# EAGLE design mikroe-adapter (EAGLE 9.6.2)

## Sheet 1 of 2
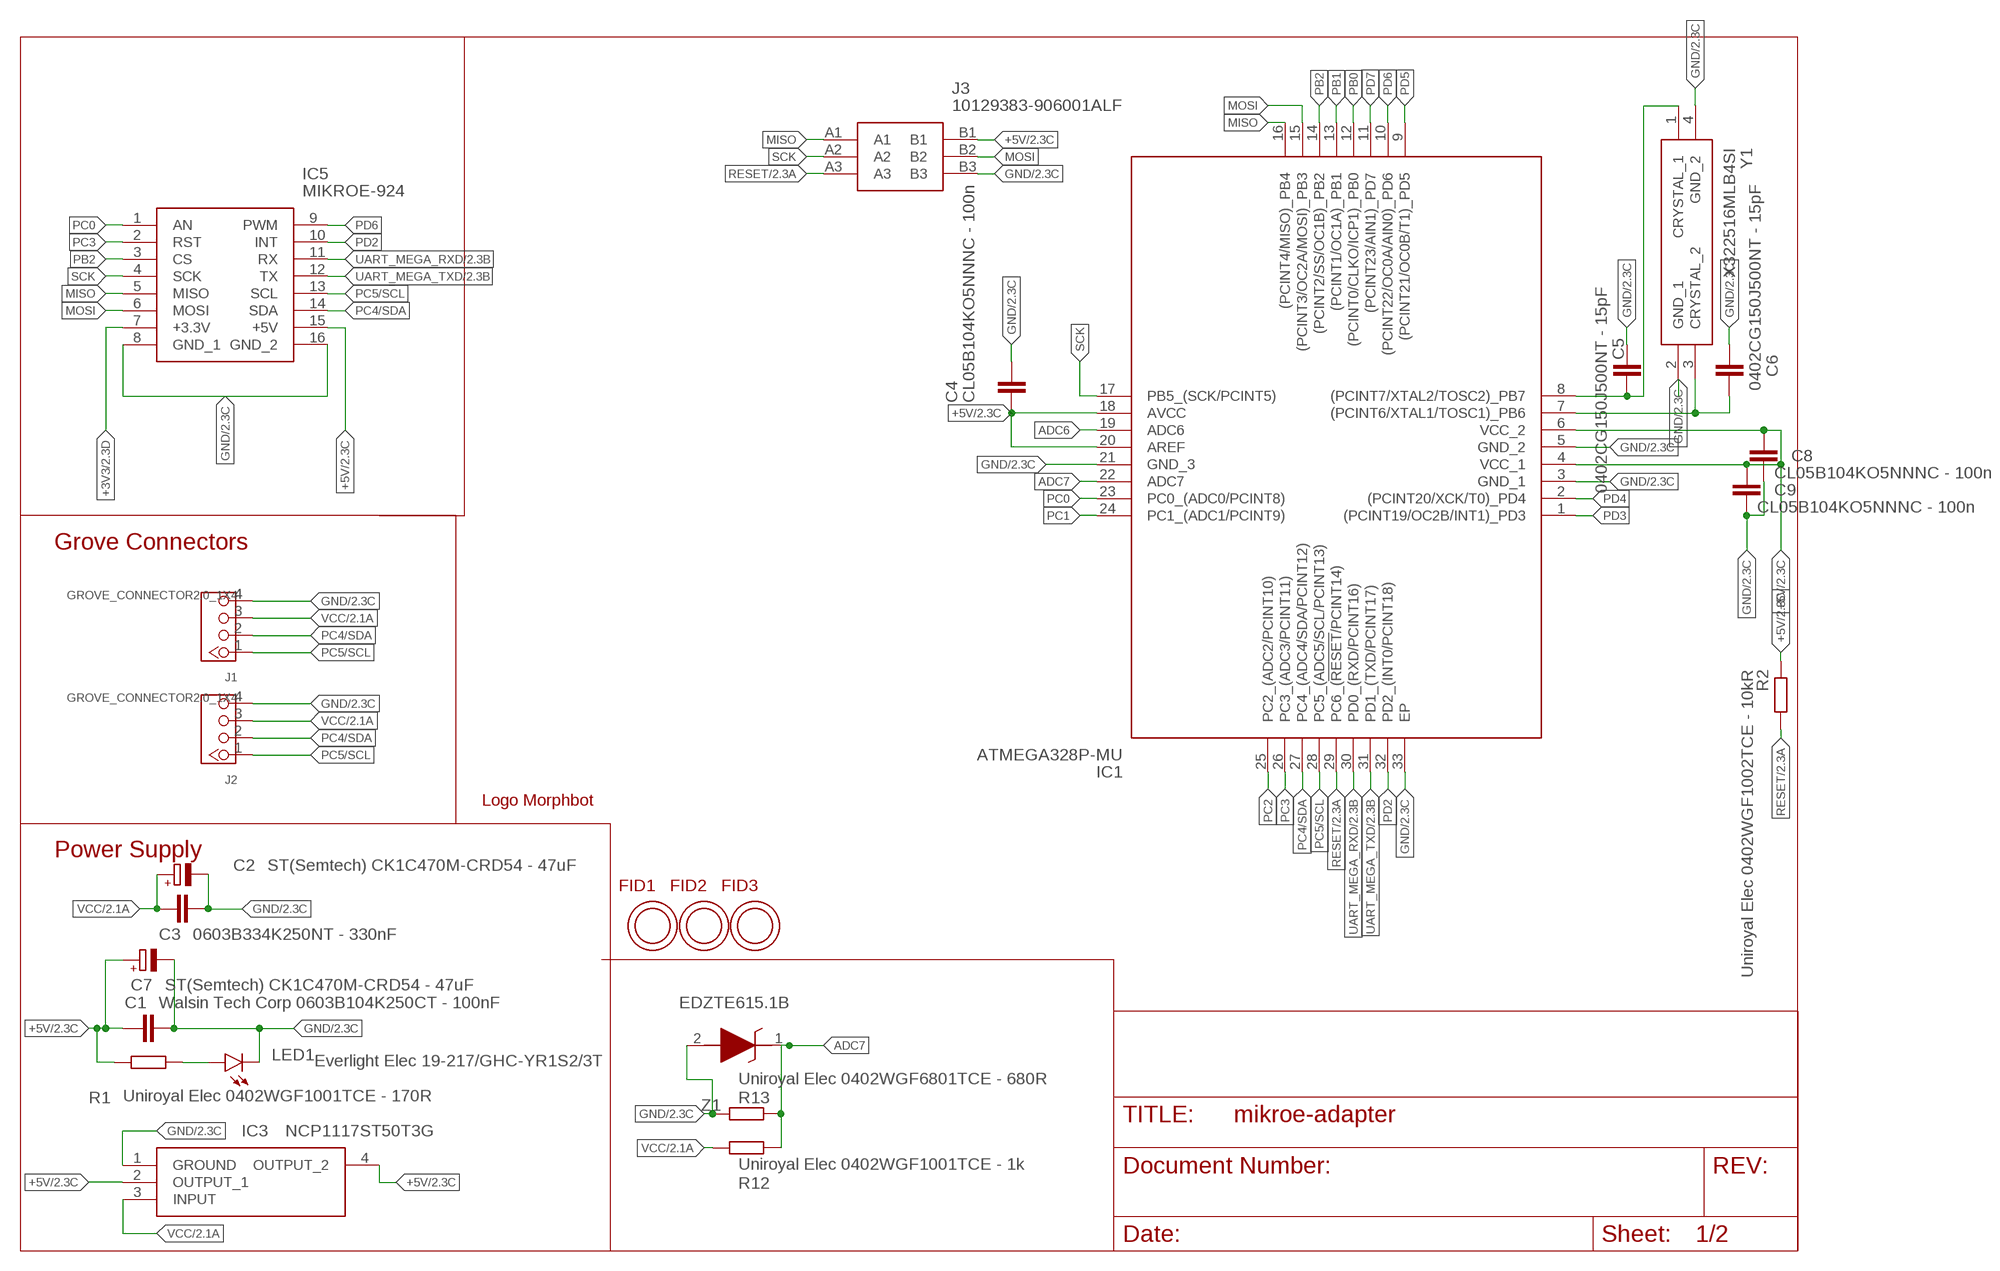
[diagram p0: schematic, sheet 1]

### Parts
C1  Walsin Tech Corp 0603B104K250CT - 100nF  C-EUC0603  [C0603]
C2  ST(Semtech) CK1C470M-CRD54 - 47uF  CPOL-EUC  [PANASONIC_C]
C3  0603B334K250NT - 330nF  C-EUC0603  [C0603]
C4  CL05B104KO5NNNC - 100n  C-EUC0402  [C0402]
C5  0402CG150J500NT - 15pF  C-EUC0402  [C0402]
C6  0402CG150J500NT - 15pF  C-EUC0402  [C0402]
C7  ST(Semtech) CK1C470M-CRD54 - 47uF  CPOL-EUC  [PANASONIC_C]
C8  CL05B104KO5NNNC - 100n  C-EUC0402  [C0402]
C9  CL05B104KO5NNNC - 100n  C-EUC0402  [C0402]
FID1  OPEN-PNP-FIDUCIAL  [OPEN-PNP-FIDUCIAL]
FID2  OPEN-PNP-FIDUCIAL  [OPEN-PNP-FIDUCIAL]
FID3  OPEN-PNP-FIDUCIAL  [OPEN-PNP-FIDUCIAL]
IC1  ATMEGA328P-MU  [QFN50P500X500X100-33N]
IC3  NCP1117ST50T3G  [SOT230P700X180-4N]
IC5  MIKROE-924  [MIKROE924]
J1  GROVE_CONNECTOR2.0_1X4  [2.0_1X4_STRAIGHT]
J2  GROVE_CONNECTOR2.0_1X4  [2.0_1X4_STRAIGHT]
J3  10129383-906001ALF  [10129383906001ALF]
LED1  Everlight Elec 19-217/GHC-YR1S2/3T  LEDCHIPLED_0603  [CHIPLED_0603]
R1  Uniroyal Elec 0402WGF1001TCE - 170R  R-EU_R0402  [R0402]
R2  Uniroyal Elec 0402WGF1002TCE - 10kR  R-EU_R0402  [R0402]
R12  Uniroyal Elec 0402WGF1001TCE - 1k  R-EU_R0402  [R0402]
R13  Uniroyal Elec 0402WGF6801TCE - 680R  R-EU_R0402  [R0402]
U$1  LOGO_MORPHBOT5MM  [LOGO_MORPHBOT]
Y1  X322516MLB4SI  [X322516MLB4SI]
Z1  EDZTE615.1B  [EMD2]

### Nets
+3V3: IC5.7(+3.3V) ; also sheet 2
+5V: C1.1 C4.1 C7.+ C8.2 C9.2 IC1.4(VCC_1) IC1.6(VCC_2) IC1.18(AVCC) IC1.20(AREF) IC3.2(OUTPUT_1) IC3.4(OUTPUT_2) IC5.15(+5V) J3.B1 R1.2 R2.2 ; also sheet 2
ADC6: IC1.19(ADC6)
ADC7: IC1.22(ADC7) R12.1 R13.2 Z1.1(K)
GND: C1.2 C2.- C3.1 C4.2 C5.1 C6.1 C7.- C8.1 C9.1 IC1.3(GND_1) IC1.5(GND_2) IC1.21(GND_3) IC1.33(EP) IC3.1(GROUND) IC5.8(GND_1) IC5.16(GND_2) J1.4 J2.4 J3.B3 LED1.C R13.1 Y1.2(GND_1) Y1.4(GND_2) Z1.2(A) ; also sheet 2
MISO: IC1.16((PCINT4/MISO)_PB4) IC5.5(MISO) J3.A1
MOSI: IC1.15((PCINT3/OC2A/MOSI)_PB3) IC5.6(MOSI) J3.B2
N$1: LED1.A R1.1
N$2: C5.2 IC1.8((PCINT7/XTAL2/TOSC2)_PB7) Y1.1(CRYSTAL_1)
N$3: C6.2 IC1.7((PCINT6/XTAL1/TOSC1)_PB6) Y1.3(CRYSTAL_2)
PB0: IC1.12((PCINT0/CLKO/ICP1)_PB0)
PB1: IC1.13((PCINT1/OC1A)_PB1)
PB2: IC1.14((PCINT2/SS/OC1B)_PB2) IC5.3(CS)
PC0: IC1.23(PC0_(ADC0/PCINT8)) IC5.1(AN)
PC1: IC1.24(PC1_(ADC1/PCINT9))
PC2: IC1.25(PC2_(ADC2/PCINT10))
PC3: IC1.26(PC3_(ADC3/PCINT11)) IC5.2(RST)
PC4/SDA: IC1.27(PC4_(ADC4/SDA/PCINT12)) IC5.14(SDA) J1.2 J2.2
PC5/SCL: IC1.28(PC5_(ADC5/SCL/PCINT13)) IC5.13(SCL) J1.1 J2.1
PD2: IC1.32(PD2_(INT0/PCINT18)) IC5.10(INT)
PD3: IC1.1((PCINT19/OC2B/INT1)_PD3)
PD4: IC1.2((PCINT20/XCK/T0)_PD4)
PD5: IC1.9((PCINT21/OC0B/T1)_PD5)
PD6: IC1.10((PCINT22/OC0A/AIN0)_PD6) IC5.9(PWM)
PD7: IC1.11((PCINT23/AIN1)_PD7)
RESET: IC1.29(PC6_(!RESET!/PCINT14)) J3.A3 R2.1 ; also sheet 2
SCK: IC1.17(PB5_(SCK/PCINT5)) IC5.4(SCK) J3.A2
UART_MEGA_RXD: IC1.30(PD0_(RXD/PCINT16)) IC5.11(RX) ; also sheet 2
UART_MEGA_TXD: IC1.31(PD1_(TXD/PCINT17)) IC5.12(TX) ; also sheet 2
VCC: C2.+ C3.2 IC3.3(INPUT) J1.3 J2.3 R12.2 ; also sheet 2

### Notes on the sheet
- Grove Connectors
- Power Supply

## Sheet 2 of 2
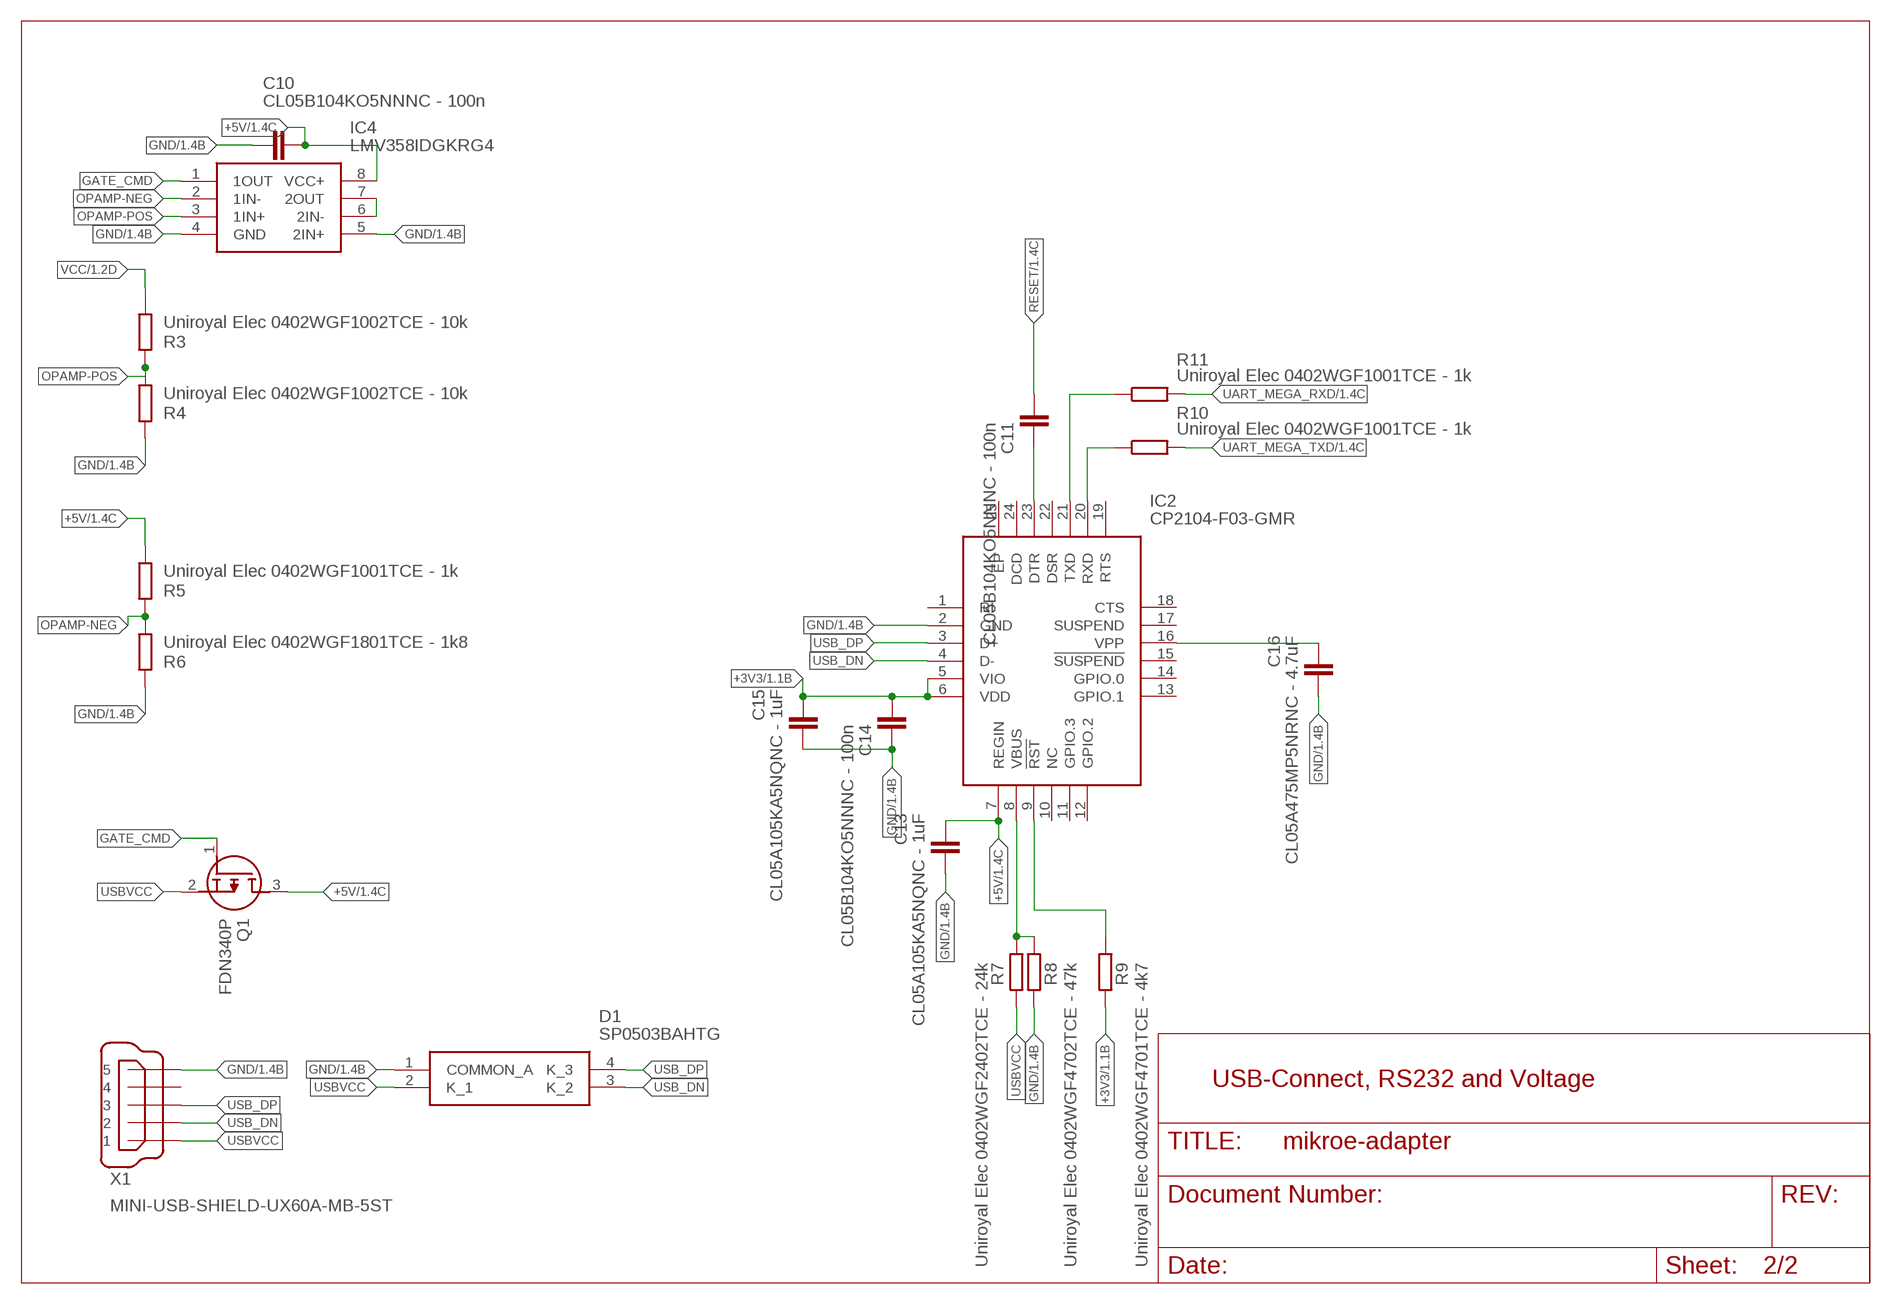
[diagram p1: schematic, sheet 2]

### Parts
C10  CL05B104KO5NNNC - 100n  C-EUC0402  [C0402]
C11  CL05B104KO5NNNC - 100n  C-EUC0402  [C0402]
C13  CL05A105KA5NQNC - 1uF  C-EUC0402  [C0402]
C14  CL05B104KO5NNNC - 100n  C-EUC0402  [C0402]
C15  CL05A105KA5NQNC - 1uF  C-EUC0402  [C0402]
C16  CL05A475MP5NRNC - 4.7uF  C-EUC0402  [C0402]
D1  SP0503BAHTG  [SP0503BAHTG]
IC2  CP2104-F03-GMR  [QFN50P400X400X80-25N]
IC4  LMV358IDGKRG4  [SOP65P490X110-8N]
Q1  FDN340P  [SOT95P237X112-3N]
R3  Uniroyal Elec 0402WGF1002TCE - 10k  R-EU_R0402  [R0402]
R4  Uniroyal Elec 0402WGF1002TCE - 10k  R-EU_R0402  [R0402]
R5  Uniroyal Elec 0402WGF1001TCE - 1k  R-EU_R0402  [R0402]
R6  Uniroyal Elec 0402WGF1801TCE - 1k8  R-EU_R0402  [R0402]
R7  Uniroyal Elec 0402WGF2402TCE - 24k  R-EU_R0402  [R0402]
R8  Uniroyal Elec 0402WGF4702TCE - 47k  R-EU_R0402  [R0402]
R9  Uniroyal Elec 0402WGF4701TCE - 4k7  R-EU_R0402  [R0402]
R10  Uniroyal Elec 0402WGF1001TCE - 1k  R-EU_R0402  [R0402]
R11  Uniroyal Elec 0402WGF1001TCE - 1k  R-EU_R0402  [R0402]
X1  MINI-USB-SHIELD-UX60A-MB-5ST  [UX60A-MB-5ST]

### Nets
+3V3: C14.2 C15.2 IC2.5(VIO) IC2.6(VDD) R9.2 ; also sheet 1
+5V: C10.2 C13.2 IC2.7(REGIN) IC4.8(VCC+) Q1.3(D) R5.1 ; also sheet 1
DTR: C11.1 IC2.23(DTR)
GATE_CMD: IC4.1(1OUT) Q1.1(G)
GND: C10.1 C13.1 C14.1 C15.1 C16.1 D1.1(COMMON_A) IC2.2(GND) IC4.4(GND) IC4.5(2IN+) R4.2 R6.2 R8.2 X1.5 ; also sheet 1
N$4: IC4.6(2IN-) IC4.7(2OUT)
N$5: IC2.8(VBUS) R7.1 R8.1
N$6: IC2.9(!RST) R9.1
N$7: C16.2 IC2.16(VPP)
N$8: IC2.21(TXD) R11.1
N$9: IC2.20(RXD) R10.1
OPAMP-NEG: IC4.2(1IN-) R5.2 R6.1
OPAMP-POS: IC4.3(1IN+) R3.2 R4.1
RESET: C11.2 ; also sheet 1
UART_MEGA_RXD: R11.2 ; also sheet 1
UART_MEGA_TXD: R10.2 ; also sheet 1
USB_DN: D1.3(K_2) IC2.4(D-) X1.2
USB_DP: D1.4(K_3) IC2.3(D+) X1.3
USBVCC: D1.2(K_1) Q1.2(S) R7.2 X1.1
VCC: R3.1 ; also sheet 1
Unconnected: IC2.1(RI) IC2.10(NC) IC2.11(GPIO.3) IC2.12(GPIO.2) IC2.13(GPIO.1) IC2.14(GPIO.0) IC2.15(!SUSPEND) IC2.17(SUSPEND) IC2.18(CTS) IC2.19(RTS) IC2.22(DSR) IC2.24(DCD) IC2.25(EP) X1.4 X1.M1(S1) X1.M2(S2) X1.M3(S3) X1.M4(S4)

### Notes on the sheet
- USB-Connect, RS232 and Voltage

## Library data of the parts
C1 C3-C6 C8-C11 C13-C16 = rcl:C-EU: CAPACITOR, European symbol; SPICEPREFIX: C
C2 C7 = rcl:CPOL-EU: POLARIZED CAPACITOR, European symbol; SPICEPREFIX: C
D1 = samacsys:SP0503BAHTG: ESD Suppressors / TVS Diodes TVS AVAL DIODE SMT Source: Datasheet <https://nl.mouser.com/datasheet/2/240/Littelfuse_TVS_Diode_Array_SP05_Datasheet.pdf-777043.pdf>; ARROW_PART_NUMBER: SP0503BAHTG; ARROW_PRICE-STOCK: https://www.arrow.com/en/products/sp0503bahtg/littelfuse; DESCRIPTION: ESD Suppressors / TVS Diodes TVS AVAL DIODE SMT; HEIGHT: 1.22mm; MANUFACTURER_NAME: LITTELFUSE; MANUFACTURER_PART_NUMBER: SP0503BAHTG; MOUSER_PART_NUMBER: 576-SP0503BAHTG; MOUSER_PRICE-STOCK: https://www.mouser.co.uk/ProductDetail/Littelfuse/SP0503BAHTG?qs=uD%2FdkN7XIa0NTYXwHdELYA%3D%3D
FID1-FID3 = topo-eng:OPEN-PNP-FIDUCIAL
IC1 = samacsys:ATMEGA328P-MU: ATMEGA328P-MU, 8 bit AVR Microcontroller 20MHz 1, 32kb Flash, 2kb RAM, I2C SPI 32-Pin MLF Source: Datasheet <http://www.atmel.com/Images/Atmel-8271-8-bit-AVR-Microcontroller-ATmega48A-48PA-88A-88PA-168A-168PA-328-328P_datasheet.pdf>; ARROW_PART_NUMBER: ATMEGA328P-MU; ARROW_PRICE-STOCK: https://www.arrow.com/en/products/atmega328p-mu/microchip-technology; DESCRIPTION: ATMEGA328P-MU, 8 bit AVR Microcontroller 20MHz 1, 32kb Flash, 2kb RAM, I2C SPI 32-Pin MLF; HEIGHT: 1mm; MANUFACTURER_NAME: Microchip; MANUFACTURER_PART_NUMBER: ATMEGA328P-MU; MOUSER_PART_NUMBER: 556-ATMEGA328P-MU; MOUSER_PRICE-STOCK: https://www.mouser.co.uk/ProductDetail/Microchip-Technology-Atmel/ATMEGA328P-MU?qs=K8BHR703ZXgI55tOEPBx9w%3D%3D
IC2 = samacsys:CP2104-F03-GMR: USB-to-UART 1-CH 576byte FIFO 3.3V Automotive 24-Pin QFN EP T/R Source: Datasheet <https://www.silabs.com/documents/public/data-sheets/cp2104.pdf>; ARROW_PART_NUMBER: CP2104-F03-GMR; ARROW_PRICE-STOCK: https://www.arrow.com/en/products/cp2104-f03-gmr/silicon-labs; DESCRIPTION: USB-to-UART 1-CH 576byte FIFO 3.3V Automotive 24-Pin QFN EP T/R; HEIGHT: 0.8mm; MANUFACTURER_NAME: Silicon Labs; MANUFACTURER_PART_NUMBER: CP2104-F03-GMR; MOUSER_PART_NUMBER: 634-CP2104-F03-GMR; MOUSER_PRICE-STOCK: https://www.mouser.co.uk/ProductDetail/Silicon-Labs/CP2104-F03-GMR?qs=1CB38rTTsYrRJKVkczeRzA%3D%3D
IC3 = samacsys:NCP1117ST50T3G: ON SEMICONDUCTOR - NCP1117ST50T3G - LDO, REG, 20VIN, 1A, 5V, 1%, SOT223-3 Source: Datasheet <http://www.onsemi.com/pub/Collateral/NCP1117-D.PDF>; ARROW_PART_NUMBER: NCP1117ST50T3G; ARROW_PRICE-STOCK: https://www.arrow.com/en/products/ncp1117st50t3g/on-semiconductor; DESCRIPTION: ON SEMICONDUCTOR - NCP1117ST50T3G - LDO, REG, 20VIN, 1A, 5V, 1%, SOT223-3; HEIGHT: 1.8mm; MANUFACTURER_NAME: ON Semiconductor; MANUFACTURER_PART_NUMBER: NCP1117ST50T3G; MOUSER_PART_NUMBER: 863-NCP1117ST50T3G; MOUSER_PRICE-STOCK: https://www.mouser.co.uk/ProductDetail/ON-Semiconductor/NCP1117ST50T3G?qs=Gev%252BmEvV0ib6dijy6U0dhQ%3D%3D
IC4 = samacsys:LMV358IDGKRG4: Operational Amplifiers - Op Amps Dual Low-Voltage Rail-to-Rail Out Source: Datasheet <http://www.ti.com/lit/ds/symlink/lmv358.pdf>; ARROW_PART_NUMBER: LMV358IDGKRG4; ARROW_PRICE-STOCK: https://www.arrow.com/en/products/lmv358idgkrg4/texas-instruments; DESCRIPTION: Operational Amplifiers - Op Amps Dual Low-Voltage Rail-to-Rail Out; HEIGHT: 1.1mm; MANUFACTURER_NAME: Texas Instruments; MANUFACTURER_PART_NUMBER: LMV358IDGKRG4; MOUSER_PART_NUMBER: 595-LMV358IDGKRG4; MOUSER_PRICE-STOCK: https://www.mouser.co.uk/ProductDetail/Texas-Instruments/LMV358IDGKRG4?qs=paYhMW8qfiuzqo4cLPZoVQ%3D%3D
IC5 = samacsys:MIKROE-924: microSD click mikroBUS Source: Datasheet <https://www.mikroe.com/microsd-click>; DESCRIPTION: microSD click mikroBUS; HEIGHT: 5mm; MANUFACTURER_NAME: MIKROELEKTRONIKA; MANUFACTURER_PART_NUMBER: MIKROE-924; MOUSER_PART_NUMBER: 932-MIKROE-924; MOUSER_PRICE-STOCK: https://www.mouser.com/Search/Refine.aspx?Keyword=932-MIKROE-924
J1 J2 = morphbot:GROVE_CONNECTOR: Seeedstudio Grove-Connector: 1 = SCL 2 = SDA 3 = VCC 4 = GND
J3 = samacsys:10129383-906001ALF: Headers & Wire Housings ECONOSTIK HEADER DR VT SMT 2X3 Source: Datasheet <https://componentsearchengine.com/Datasheets/1/10129383-906001ALF.pdf>; ARROW_PART_NUMBER: 10129383-906001ALF; ARROW_PRICE-STOCK: https://www.arrow.com/en/products/10129383-906001alf/amphenol-fci; DESCRIPTION: Headers & Wire Housings ECONOSTIK HEADER DR VT SMT 2X3; HEIGHT: 8.58mm; MANUFACTURER_NAME: Amphenol; MANUFACTURER_PART_NUMBER: 10129383-906001ALF; MOUSER_PART_NUMBER: 649-1012938390601ALF; MOUSER_PRICE-STOCK: https://www.mouser.co.uk/ProductDetail/Amphenol-FCI/10129383-906001ALF?qs=0lQeLiL1qyZsINMRDvT9Pw%3D%3D
LED1 = led:LED: LED OSRAM: - CHIPLED LG R971, LG N971, LY N971, LG Q971, LY Q971, LO R971, LY R971 LH N974, LH R974 LS Q976, LO Q976, LY Q976 LO Q996 - Hyper CHIPLED LW Q18S LB Q993, LB Q99A, LB R99A - SideLED LS A670, LO A670, LY A670, LG A670, LP A670 LB A673, LV A673, LT A673, LW A673 LH A674 LY A675 LS A676, LA A676, LO A676, LY A676, LW A676 LS A679, LY A679, LG A679 - Hyper Micro SIDELED® LS Y876, LA Y876, LO Y876, LY Y876 LT Y87S - SmartLED LW L88C, LW L88S LB L89C, LB L89S, LG L890 LS L89K, LO L89K, LY L89K LS L896, LA L896, LO L896, LY L896 - TOPLED LS T670, LO T670, LY T670, LG T670, LP T670 LSG T670, LSP T670, LSY T670, LOP T670, LYG T670 LG T671, LOG T671, LSG T671 LB T673, LV T673, LT T673, LW T673 LH T674 LS T676, LA T676, LO T676, LY T676, LB T676, LH T676, LSB T676, LW T676 LB T67C, LV T67C, LT T67C, LS T67K, LO T67K, LY T67K, LW E67C LS E67B, LA E67B, LO E67B, LY E67B, LB E67C, LV E67C, LT E67C LW T67C LS T679, LY T679, LG T679 LS T770, LO T770, LY T770, LG T770, LP T770 LB T773, LV T773, LT T773, LW T773 LH T774 LS E675, LA E675, LY E675, LS T675 LS T776, LA T776, LO T776, LY T776, LB T776 LHGB T686 LT T68C, LB T68C - Hyper Mini TOPLED® LB M676 - Mini TOPLED Santana® LG M470 LS M47K, LO M47K, LY M47K Source: http://www.osram.convergy.de LUXEON: - LUMILED® LXK2-PW12-R00, LXK2-PW12-S00, LXK2-PW14-U00, LXK2-PW14-V00 LXK2-PM12-R00, LXK2-PM12-S00, LXK2-PM14-U00 LXK2-PE12-Q00, LXK2-PE12-R00, LXK2-PE12-S00, LXK2-PE14-T00, LXK2-PE14-U00 LXK2-PB12-K00, LXK2-PB12-L00, LXK2-PB12-M00, LXK2-PB14-N00, LXK2-PB14-P00, LXK2-PB14-Q00 LXK2-PR12-L00, LXK2-PR12-M00, LXK2-PR14-Q00, LXK2-PR14-R00 LXK2-PD12-Q00, LXK2-PD12-R00, LXK2-PD12-S00 LXK2-PH12-R00, LXK2-PH12-S00 LXK2-PL12-P00, LXK2-PL12-Q00, LXK2-PL12-R00 Source: www.luxeon.com KINGBRIGHT: KA-3528ASYC Source: www.kingbright.com
Q1 = samacsys:FDN340P: Trans MOSFET P-CH 20V 2A 3-Pin SuperSOT Source: Datasheet <https://www.onsemi.com/pub/Collateral/FDN340P-D.PDF>; ARROW_PART_NUMBER: FDN340P; ARROW_PRICE-STOCK: https://www.arrow.com/en/products/fdn340p/on-semiconductor; DESCRIPTION: Trans MOSFET P-CH 20V 2A 3-Pin SuperSOT; HEIGHT: 1.12mm; MANUFACTURER_NAME: ON Semiconductor; MANUFACTURER_PART_NUMBER: FDN340P; MOUSER_PART_NUMBER: 512-FDN340P; MOUSER_PRICE-STOCK: https://www.mouser.co.uk/ProductDetail/ON-Semiconductor-Fairchild/FDN340P?qs=AMp2PTjoga9dhzFXRaqTZw%3D%3D
R1-R13 = rcl:R-EU_: RESISTOR, European symbol; SPICEPREFIX: R
U$1 = topo-eng:LOGO_MORPHBOT
X1 = con-hirose:MINI-USB-SHIELD-: MINI USB Connector Source: http://www.hirose.co.jp/cataloge_hp/e24000019.pdf; OC_FARNELL: unknown; OC_NEWARK: unknown
Y1 = samacsys:X322516MLB4SI: Crystal Source: Datasheet <https://datasheet.lcsc.com/szlcsc/Yangxing-Tech-X322516MLB4SI_C13738.pdf>; DESCRIPTION: Crystal; HEIGHT: 0.8mm; MANUFACTURER_NAME: Yangxing Tech; MANUFACTURER_PART_NUMBER: X322516MLB4SI
Z1 = samacsys:EDZTE615.1B: ROHM EDZTE615.1B Zener Diode, 5.1V 2% 0.1 W SMT 2-Pin EMD Source: Datasheet <https://www.rohm.com/datasheet/EDZ5.1B>; DESCRIPTION: ROHM EDZTE615.1B Zener Diode, 5.1V 2% 0.1 W SMT 2-Pin EMD; HEIGHT: mm; MANUFACTURER_NAME: ROHM Semiconductor; MANUFACTURER_PART_NUMBER: EDZTE615.1B; MOUSER_PART_NUMBER: 755-EDZTE615.1B; MOUSER_PRICE-STOCK: https://www.mouser.co.uk/ProductDetail/ROHM-Semiconductor/EDZTE6151B?qs=4kLU8WoGk0uAJO8EOvJm8g%3D%3D

## Board
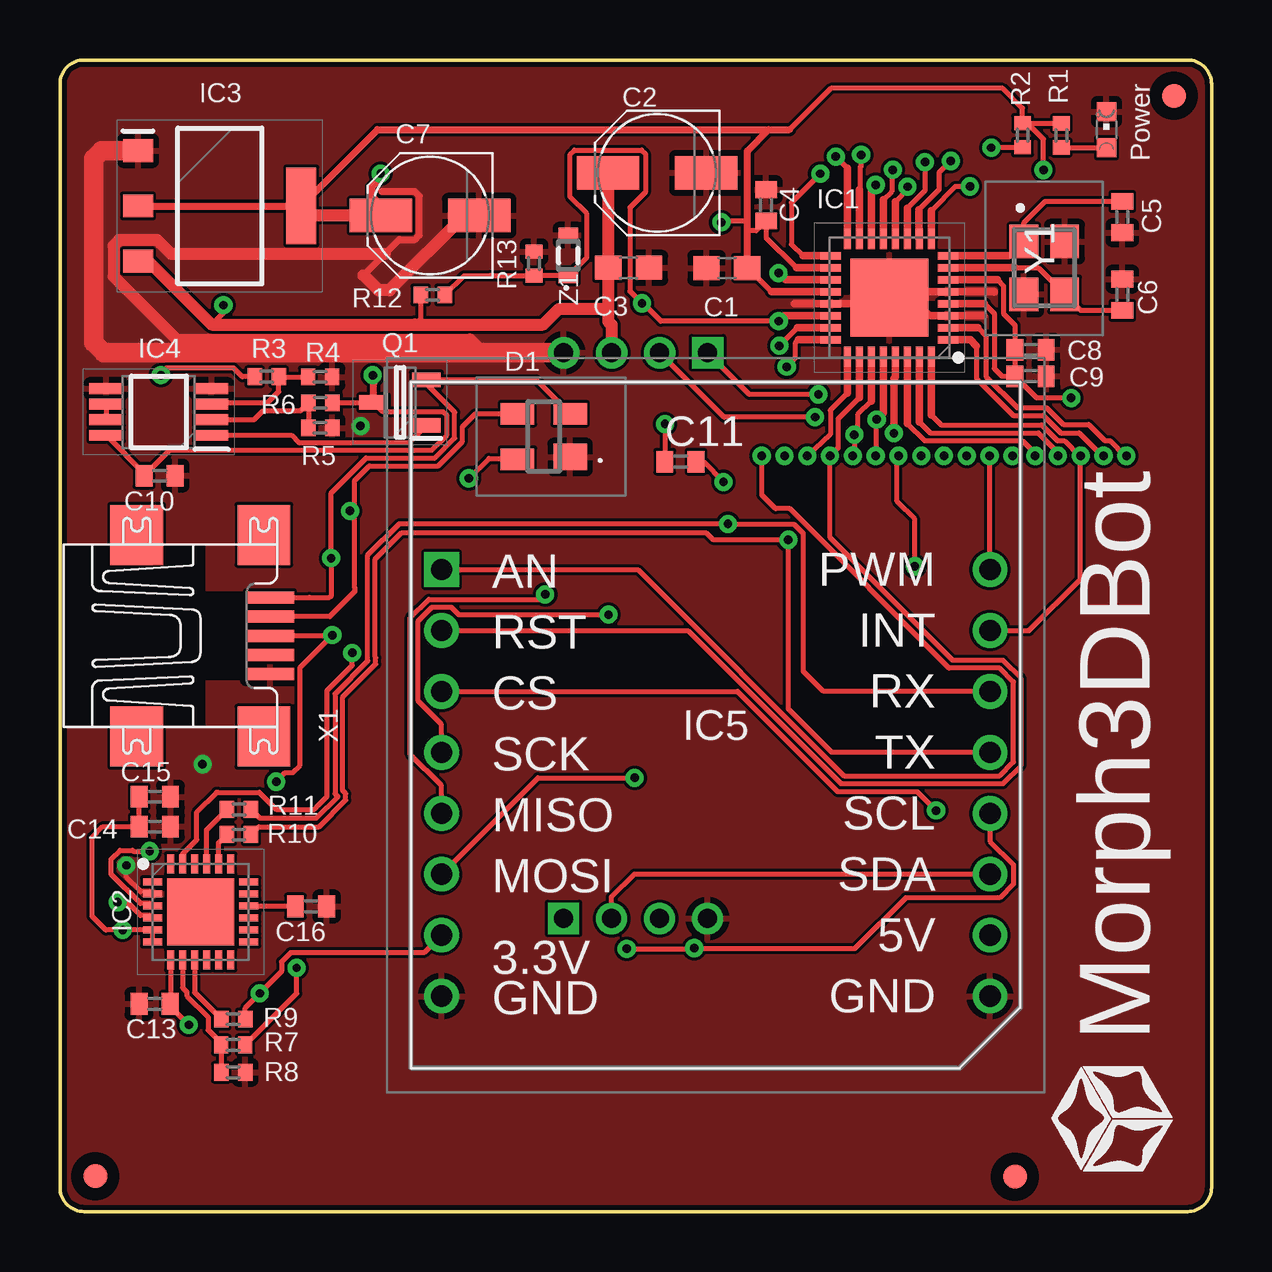
[diagram p2: board, top side]
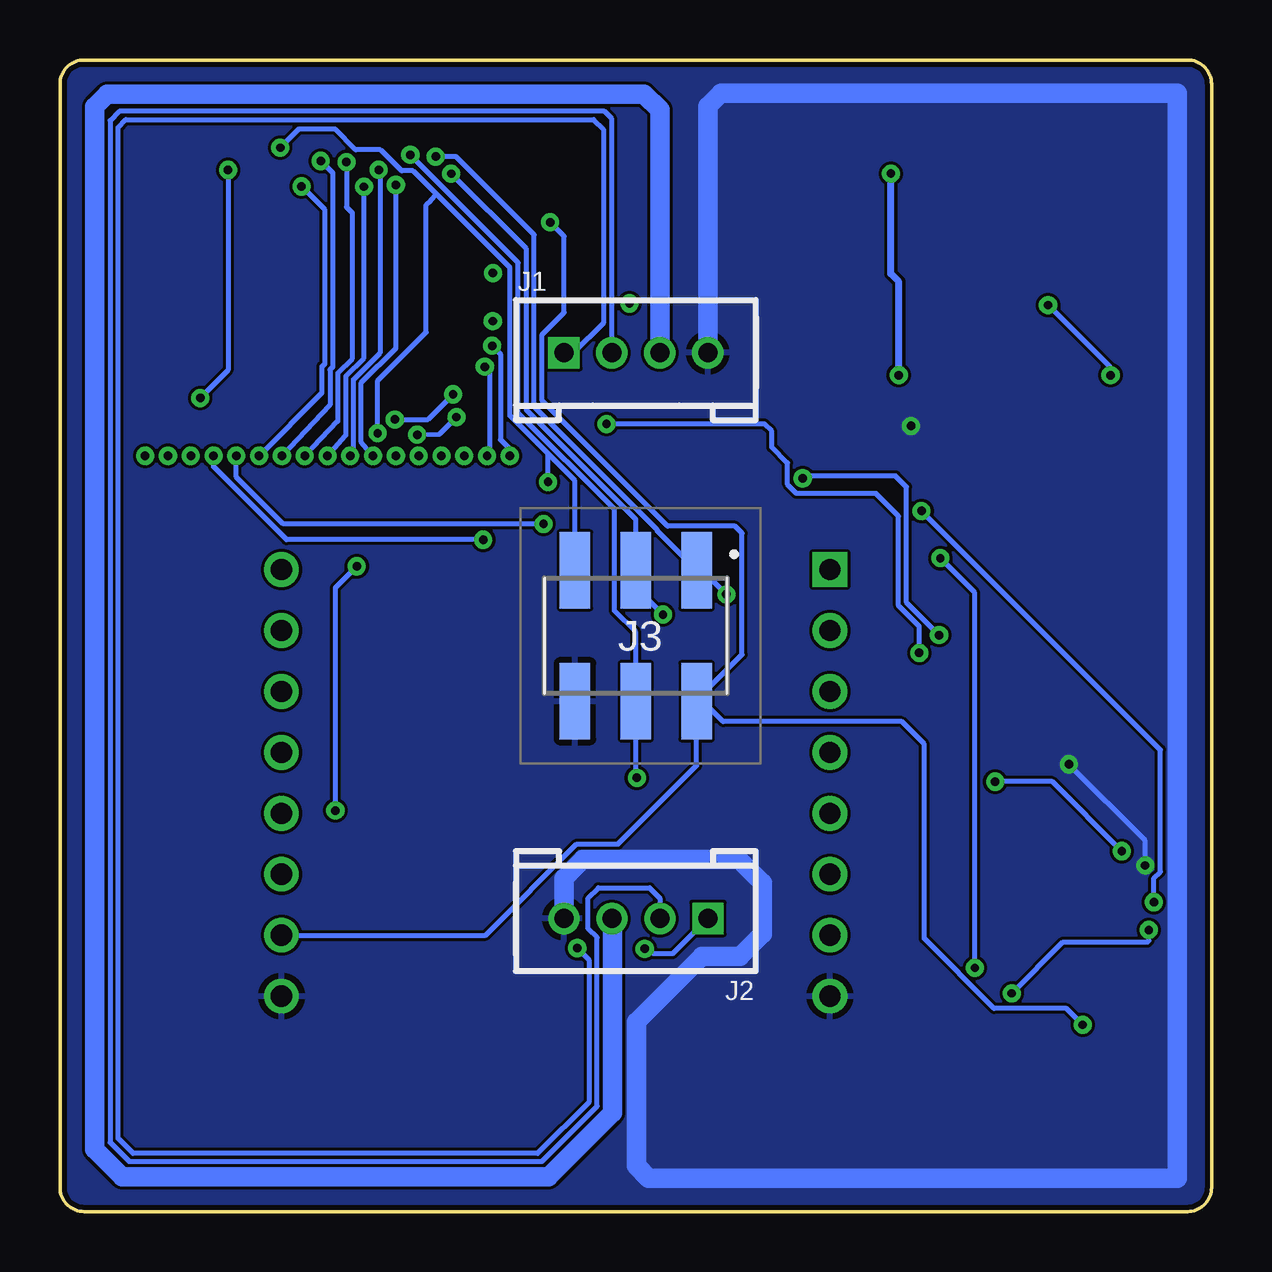
[diagram p3: board, bottom side, seen from below]

Size 48 x 48 mm. Coordinates in mm from the lower left corner, seen from the top.
Outline: 47,0 1,0 arc-90 0,1 0,47 arc-90 1,48 47,48 arc-90 48,47 48,1 arc-90 47,0
Copper layers (1*16): Top 0.035mm / dielectric 0.2mm / Bottom 0.035mm
Design rules "jlcpcb_4_layer *": minimum track width 3.5mil, minimum drill 0.2mm, track to track 5mil, track to pad 6mil, pad to pad 6mil, via to via 6mil, smd to smd 6mil, copper to edge 0.2mm, drill to drill 6mil, minimum pad ring 10mil, minimum via ring 8mil, stop-mask expansion 4mil, vias tented up to drill 0mil, thermal gap 10mil
bKeepout: area 24,0 to 48,48; area 0,0 to 24,48

### Footprints (pad centres in the part's own frame; a part is rotated, then mirrored left to right if it is on the bottom)
C0603 = smd 1.1 x 1: 1 -0.85,0; 2 0.85,0
PANASONIC_C = smd 2.6 x 1.4: + 2.05,0; - -2.05,0
C0402 = smd 0.7 x 0.9: 1 -0.65,0; 2 0.65,0
SP0503BAHTG = smd 1.1 x 1.4: 1 -0.85,-1.1 | smd 0.9 x 1.4: 2 0.95,-1.1; 3 0.95,1.1; 4 -0.95,1.1
OPEN-PNP-FIDUCIAL = smd 1 x 1: FID$1 0,0
QFN50P500X500X100-33N = smd 0.85 x 0.3: 1 -2.45,1.75; 2 -2.45,1.25; 3 -2.45,0.75; 4 -2.45,0.25; 5 -2.45,-0.25; 6 -2.45,-0.75; 7 -2.45,-1.25; 8 -2.45,-1.75; 17 2.45,-1.75; 18 2.45,-1.25; 19 2.45,-0.75; 20 2.45,-0.25; 21 2.45,0.25; 22 2.45,0.75; 23 2.45,1.25; 24 2.45,1.75 | smd 0.3 x 0.85: 9 -1.75,-2.45; 10 -1.25,-2.45; 11 -0.75,-2.45; 12 -0.25,-2.45; 13 0.25,-2.45; 14 0.75,-2.45; 15 1.25,-2.45; 16 1.75,-2.45; 25 1.75,2.45; 26 1.25,2.45; 27 0.75,2.45; 28 0.25,2.45; 29 -0.25,2.45; 30 -0.75,2.45; 31 -1.25,2.45; 32 -1.75,2.45 | smd 3.25 x 3.25: 33 0,0
QFN50P400X400X80-25N = smd 0.8 x 0.3: 1 -2,1.25; 2 -2,0.75; 3 -2,0.25; 4 -2,-0.25; 5 -2,-0.75; 6 -2,-1.25; 13 2,-1.25; 14 2,-0.75; 15 2,-0.25; 16 2,0.25; 17 2,0.75; 18 2,1.25 | smd 0.3 x 0.8: 7 -1.25,-2; 8 -0.75,-2; 9 -0.25,-2; 10 0.25,-2; 11 0.75,-2; 12 1.25,-2; 19 1.25,2; 20 0.75,2; 21 0.25,2; 22 -0.25,2; 23 -0.75,2; 24 -1.25,2 | smd 2.8 x 2.8: 25 0,0
SOT230P700X180-4N = smd 1.25 x 0.95: 1 -3.4,2.3; 2 -3.4,0; 3 -3.4,-2.3 | smd 1.25 x 3.2: 4 3.4,0
SOP65P490X110-8N = smd 1.4 x 0.45: 1 -2.2,0.975; 2 -2.2,0.325; 3 -2.2,-0.325; 4 -2.2,-0.975; 5 2.2,-0.975; 6 2.2,-0.325; 7 2.2,0.325; 8 2.2,0.975
MIKROE924 = drill 0.889 pad 1.445 square: 1 0,0 | drill 0.889 pad 1.445: 2 0,-2.54; 3 0,-5.08; 4 0,-7.62; 5 0,-10.16; 6 0,-12.7; 7 0,-15.24; 8 0,-17.78; 9 22.86,0; 10 22.86,-2.54; 11 22.86,-5.08; 12 22.86,-7.62; 13 22.86,-10.16; 14 22.86,-12.7; 15 22.86,-15.24; 16 22.86,-17.78
2.0_1X4_STRAIGHT = drill 0.8 pad 1.27 square: 1 1.83,-1.786 | drill 0.8 pad 1.27: 2 3.83,-1.786; 3 5.83,-1.786; 4 7.83,-1.786
10129383906001ALF = smd 1.27 x 3.18: A1 -2.54,-2.73; A2 0,-2.73; A3 2.54,-2.73; B1 -2.54,2.73; B2 0,2.73; B3 2.54,2.73
CHIPLED_0603 = smd 0.8 x 0.8: A 0,-0.75; C 0,0.75
SOT95P237X112-3N = smd 1.2 x 0.6: 1 -1.1,0.95; 2 -1.1,-0.95; 3 1.1,0
R0402 = smd 0.6 x 0.7: 1 -0.5,0; 2 0.5,0
UX60A-MB-5ST = smd 2 x 0.5: 1 2.25,1.6; 2 2.25,0.8; 3 2.25,0; 4 2.25,-0.8; 5 2.25,-1.6 | smd 2.2 x 2.5: M1 -3.3,-4.2; M2 -3.3,4.2; M3 2,4.2; M4 2,-4.2
X322516MLB4SI = smd 1.4 x 1.2: 1 -1.1,-0.85; 2 1.1,-0.85; 3 1.1,0.85; 4 -1.1,0.85
EMD2 = smd 0.6 x 0.8: 1 -0.85,0; 2 0.85,0

### Placement (x,y rotation side)
C1  27.8,39.33 180 top
C2  24.89,43.29 180 top
C3  23.7,39.34 180 top
C4  29.43,41.94 90 top
C5  44.28,41.45 90 top
C6  44.28,38.22 270 top
C7  15.43,41.52 180 top
C8  40.46,35.92 180 top
C9  40.46,34.82 180 top
C10  4.15,30.67 180 top
C11  25.86,31.26 0 top
C13  3.95,8.66 0 top
C14  3.96,16.05 180 top
C15  3.96,17.29 180 top
C16  10.46,12.72 180 top
D1  20.17,32.3 90 top
FID1  1.47,1.47 0 top
FID2  39.8,1.45 0 top
FID3  46.43,46.5 0 top
IC1  34.57,38.08 180 top
IC2  5.86,12.49 0 top
IC3  6.66,41.92 0 top
IC4  4.12,33.33 180 top
IC5  15.91,26.76 0 top
J1  28.83,37.58 0 bottom
J2  19.16,10.43 180 bottom
J3  24,24 180 bottom
LED1  43.62,45.09 0 top
Q1  14.17,33.72 180 top
R1  41.74,44.85 90 top
R2  40.12,44.86 90 top
R3  8.62,34.8 0 top
R4  10.84,34.79 0 top
R5  10.86,33.71 180 top
R6  10.85,32.66 0 top
R7  7.22,6.95 0 top
R8  7.22,5.8 0 top
R9  7.22,8.02 0 top
R10  7.46,15.71 0 top
R11  7.47,16.76 0 top
R12  15.54,38.21 180 top
R13  19.76,39.51 270 top
U$1  46.63,1.12 90 top
X1  6.5,24 0 top
Y1  41.03,39.33 270 top
Z1  21.19,39.85 90 top

### Tracks (layer width: path | path; a pad name or v marks a point on that pad's centre or on a via)
+3V3  (via drill 0.35)
  Top 0.2: IC2.6 IC2.5 v2.61,11.74 1.91,11.74 1.34,12.3 1.34,15.6 1.79,16.05 C14.2 C15.2 | R9.2 7.72,8.49 v8.33,9.09 9.23,10 9.23,10.42 9.6,10.79 15.18,10.79 IC5.7
  Bottom 0.2: v8.33,9.09 8.32,9.1 6.19,11.23 2.68,11.23 2.61,11.3 v2.61,11.74
+5V  (via drill 0.35)
  Top 0.2: 30.41,45.09 32.14,46.82 39.3,46.82 40.12,46 R2.2 40.33,45.37 | 40.33,45.37 41.73,45.37 R1.2 | v40.99,43.42 40.99,44.7 40.33,45.37 | v27.57,41.23 27.64,41.3 28.65,41.3 | C8.2 39.81,36.95 39.33,37.43 39.33,38.58 39.07,38.83 | C9.2 39.27,34.82 38.94,35.14 38.94,37.43 38.54,37.83 | C8.2 | C8.2 C9.2 | v42.15,33.91 40.72,33.91 C9.2 | 28.65,40.88 29.02,40.88 C4.1 29.43,40.6 30.69,39.34 | IC1.18 | 29.65,38.33 C1.1 | R5.1 Q1.3 13.47,33.33 15.98,33.33 16.13,33.18 16.13,32.37 15.49,31.73 4.57,31.73 C10.2 3.5,30.77 IC4.8 | C13.2 4.61,8.67 IC2.7 4.61,8.54 v5.37,7.78
  Top 0.3: 29.54,45.09 30.41,45.09 | C1.1 28.65,40.88 28.65,41.3 28.65,44.21 29.54,45.09 | IC3.2 9.97,41.91 IC3.4 13.24,45.09 29.54,45.09 | Q1.3 13.07,34.52 13.04,34.55 v13.04,34.86 | C7.+ 13.38,41.95 12.99,42.34 12.99,42.7 13.37,43.07 v13.37,43.26
  Top 0.305: IC1.6 39.07,38.83 | IC1.4 38.54,37.83 | IC1.18 30.69,39.34 | IC1.20 29.65,38.33
  Top 0.5: C7.+ 13.1,41.52 10.37,41.52 9.97,41.91
  Bottom 0.2: J3.B1 21.46,21.32 19.57,23.22 19.57,28.28 19.86,28.57 22.67,28.57 27.9,33.8 27.9,36.56 26.98,37.48 26.98,40.65 v27.57,41.23 | v40.99,43.42 40.99,35.07 v42.15,33.91 | v5.37,7.78 6.05,8.46 9.06,8.46 11.98,11.38 11.98,19.48 12.91,20.42 20.36,20.42 21.21,21.27 J3.B1 | IC5.15 30.26,11.52 26.46,15.32 24.73,15.32 21.46,18.59 J3.B1
  Bottom 0.3: v13.04,34.86 13.04,38.76 13.37,39.08 v13.37,43.26
ADC6  (via drill 0.35)
  Top 0.2: 30.24,38.83 v29.95,39.12
  Top 0.305: IC1.19 30.24,38.83
ADC7  (via drill 0.35)
  Top 0.2: 30.18,37.33 v29.96,37.11 25.05,37.11 24.31,37.85 v24.26,37.85 23.75,38.36 23.75,41.84 24.4,42.49 24.4,44.1 24.25,44.24 21.44,44.24 21.26,44.07 21.26,42.29 21.96,41.59 21.96,39.78 Z1.1 21.18,39.01 R13.2 17.93,39.01 16.84,39.01 R12.1
  Top 0.305: IC1.22 30.18,37.33
DTR  (via drill 0.35)
  Top 0.2: IC2.23 5.11,14.91 5.6,15.39 5.71,15.5 5.71,16.66 6.52,17.47 6.59,17.47 8.31,17.47 9.01,16.77 10.61,16.77 10.78,16.94 11.13,17.3 11.13,21.72 11.45,22.04 12.18,22.76 v12.18,23.29 | v25.22,32.83 C11.1
  Bottom 0.2: v12.18,23.29 12.18,24.39 13.04,25.25 13.04,28.99 13.99,29.93 17.31,29.93 17.68,30.3 17.68,31.2 18.33,31.86 18.33,32.52 18.64,32.83 v25.22,32.83
GATE_CMD
  Top 0.2: IC4.1 9.65,32.36 9.94,32.06 14.56,32.06 Q1.1
GND  (via drill 0.35)
  Top 0.2: IC1.21 34.32,37.83 IC1.33 34.82,38.33 | 35.8,37.83 36.3,37.33 | IC2.2 3.77,13.34 3.36,13.34 2.76,13.93 v2.76,14.43 | IC1.3
  Top 0.3: 13.41,42.52 14.8,42.52 14.98,42.34 14.98,40.69 14.8,40.51 14.14,40.51 13.54,39.91 12.65,39.02
  Top 0.305: 34.82,38.33 IC1.5 38.94,38.33 38.95,38.33 | 35.8,37.83 IC1.21 30.62,37.83 | 36.3,37.33 IC1.3 38.51,37.33 | 38.51,37.33
  Top 0.5: 17.63,35.8 17.09,36.34 4.86,36.34 2.23,38.97 2.23,40.26 2.46,40.49 4.05,40.49 4.63,39.91 13.54,39.91 | C7.- 16.86,41.52 13.75,38.41 13.27,38.41 12.65,39.02 | 13.54,39.91
  Top 0.813: IC3.1 1.74,44.22 1.41,43.88 1.41,36.22 1.83,35.8 17.63,35.8 J1.4
  Bottom 0.2: v2.76,14.43 2.76,15.47 v5.94,18.64
  Bottom 0.813: J1.4 21,46.07 20.45,46.61 1.42,46.61 1.42,1.39 23.46,1.39 23.98,1.9 23.98,7.9 21.23,10.64 19.65,10.64 18.72,11.57 18.72,13.7 19.7,14.68 26.2,14.68 26.99,13.89 J2.4
  other vias: 12.53,32.75
  pour Bottom: 1,0 arc-90 0,1 0,47 arc-90 1,48 47,48 arc-90 48,47 48,1 arc-90 47,0
  pour Top: 1,0 arc-90 0,1 0,47 arc-90 1,48 47,48 arc-90 48,47 48,1 arc-90 47,0
MISO  (via drill 0.35)
  Top 0.2: v32.34,43.98 32.82,43.49 | 32.82,43.49 | IC5.5 15.91,17.76 14.6,19.06 14.6,24.76 15.37,25.52 20.02,25.52 v20.23,25.72
  Top 0.305: 32.82,43.49 IC1.16
  Bottom 0.2: v32.34,43.98 31.49,43.98 28.23,40.72 28.23,33.54 23.11,28.43 23.11,28.38 J3.A1 21.23,26.73 v20.23,25.72
MOSI  (via drill 0.35)
  Top 0.2: 33.32,42.6 33.36,42.64 33.36,43.55 33.4,43.58 v33.4,44.05 | IC5.6 19.92,18.08 v23.95,18.08
  Top 0.305: IC1.15 33.32,42.6
  Bottom 0.2: v33.4,44.05 28.9,39.55 28.9,33.29 24.89,29.27 24.89,25.04 24,24.15 J3.B2 24,18.12 v23.95,18.08
N$1
  Top 0.2: R1.1 43.61,44.35 LED1.A
N$2
  Top 0.2: C5.2 41.07,42.1 40.18,41.21 Y1.1 40.17,40.44 39.56,39.83
  Top 0.305: IC1.8 39.56,39.83
N$3
  Top 0.2: Y1.3 42.03,38.07 | 42.03,38.07 42.54,37.57 C6.2 | 39.8,39.33 40.77,39.33 42.03,38.07
  Top 0.305: IC1.7 39.8,39.33
N$4
  Top 0.2: IC4.6 IC4.7
N$5
  Top 0.2: IC2.8 5.11,9.33 5.29,9.15 5.29,9 6.17,8.11 6.17,7.57 6.72,7.02 R7.1 6.72,5.83 6.71,5.82 R8.1
N$6
  Top 0.2: IC2.9 5.61,9.13 R9.1
N$7
  Top 0.2: IC2.16 9.79,12.74 C16.2
N$8
  Top 0.2: IC2.21 6.11,15.91 R11.1
N$9
  Top 0.2: IC2.20 6.61,15.37 R10.1
OPAMP-NEG
  Top 0.2: R6.1 10.36,32.67 R5.2 10.03,33.38 8.47,33.38 8.09,33.01 IC4.2
OPAMP-POS
  Top 0.2: IC4.3 6.37,33.71 8.66,33.71 9.12,34.17 R3.2 R4.1
PB0  (via drill 0.35)
  Top 0.2: 34.81,42.1 35.33,42.62 v35.33,42.72
  Top 0.305: IC1.12 34.81,42.1
  Bottom 0.2: v36.85,31.5 36.09,32.34 36.09,34.81 35.33,35.58 v35.33,42.72
PB1  (via drill 0.35)
  Top 0.2: 34.32,42.17 34.67,42.52 34.67,43.38 v34.72,43.42
  Top 0.305: IC1.13 34.32,42.17
  Bottom 0.2: v34.72,43.42 v34.72,43.41 34.66,43.36 34.66,35.78 35.77,34.68 35.77,31.66 v35.9,31.5
PB2  (via drill 0.35)
  Top 0.2: v34,42.79 33.82,42.61 | IC5.3 28.25,21.68 32.41,17.51 35.72,17.51 v36.52,16.71 | v35.63,26.89 35.63,28.86 34.89,29.59 34.89,31.44 v34.95,31.5
  Top 0.305: IC1.14 33.82,42.61
  Bottom 0.2: v34,42.79 34,35.98 35.44,34.54 35.44,32.06 v34.95,31.5 | v36.52,16.71 36.52,26.01 v35.63,26.89
PC0  (via drill 0.35)
  Top 0.2: 30.73,36.83 v29.98,36.09 | IC5.1 24.09,26.76 32.69,18.16 39.17,18.16 39.74,18.73 39.74,22.08 39.17,22.65 37.06,22.65 30.42,29.29 29.83,29.29 29.25,29.87 v29.25,31.5
  Top 0.305: IC1.23 30.73,36.83
  Bottom 0.2: v29.98,36.09 29.64,35.74 29.64,32.18 29.25,31.79 v29.25,31.5
PC1  (via drill 0.35)
  Top 0.2: 30.78,36.33 30.64,36.2 30.64,35.56 v30.29,35.21
  Top 0.305: IC1.24 30.78,36.33
  Bottom 0.2: v30.29,35.21 30.09,35.01 30.09,31.61 v30.2,31.5
PC2  (via drill 0.35)
  Top 0.2: 32.82,34.12 32.11,33.4 32.11,32.39 v31.15,31.5
  Top 0.305: IC1.25 32.82,34.12
PC3  (via drill 0.35)
  Top 0.2: 33.32,33.92 32.44,33.03 32.44,31.81 v32.1,31.5 32.1,28.09 37.22,22.98 39.3,22.98 40.07,22.22 40.07,18.6 39.3,17.84 32.55,17.84 26.17,24.22 IC5.2
  Top 0.305: IC1.26 33.32,33.92
PC4/SDA  (via drill 0.35)
  Top 0.2: 33.82,33.78 33.25,33.21 33.25,32.52 v33.11,32.38 33.11,31.56 v33.05,31.5 | v31.47,33.11 27.69,33.11 J1.2 | IC5.14 23.94,14.06 22.98,13.09 22.98,12.23 J2.2
  Top 0.305: IC1.27 33.82,33.78
  Bottom 0.2: J1.2 25,45.54 25.31,45.86 45.53,45.86 45.91,45.48 45.91,2.88 45.12,2.09 27.92,2.09 25.61,4.39 25.61,11.42 25.98,11.79 25.98,13.07 25.55,13.49 23.43,13.49 22.99,13.06 J2.2 | v31.47,33.11 32.19,32.4 33.1,32.4 v33.11,32.38
PC5/SCL  (via drill 0.35)
  Top 0.2: v26.44,10.98 26.43,10.95 | v23.63,10.95 26.43,10.95 | v31.62,34.06 28.73,34.06 J1.1 | v34,31.5 34,32.97 v34.04,33.02 34.32,33.3 | 26.43,10.95 33.12,10.95 35.25,13.08 39.17,13.08 39.74,13.65 39.74,14.46 38.77,15.44 IC5.13
  Top 0.305: IC1.28 34.32,33.3
  Bottom 0.2: J2.1 22.46,10.74 23.26,10.74 v23.63,10.95 | v26.44,10.98 25.96,10.49 25.96,4.55 28.08,2.42 44.96,2.42 45.58,3.04 45.58,32.95 45.58,45.19 45.25,45.51 25.76,45.51 25.35,45.11 25.35,37.04 26.59,35.8 J1.1 | v31.62,34.06 32.66,33.02 v34.04,33.02
PD2  (via drill 0.35)
  Top 0.2: 36.32,33.2 36.74,32.78 40.92,32.78 41.58,32.13 41.86,32.13 42.49,31.5 | 42.49,31.5 v42.55,31.5 | IC5.10 40.39,24.22 42.52,26.34 42.52,31.47 42.49,31.5
  Top 0.305: IC1.32 36.32,33.2
PD3  (via drill 0.35)
  Top 0.2: 38.2,36.07 38.2,34.72 39.74,33.18 40.99,33.18 41.71,32.46 42.48,32.46 43.44,31.5 v43.5,31.5
  Top 0.305: IC1.1 37.94,36.33 38.2,36.07
PD4  (via drill 0.35)
  Top 0.2: IC1.2 | 38.26,36.84 38.6,36.49 38.6,34.81 39.9,33.51 41.12,33.51 41.83,32.81 42.88,32.81 43.56,32.13 43.76,32.13 44.39,31.5 v44.45,31.5
  Top 0.305: 38.26,36.84 IC1.2
PD5  (via drill 0.35)
  Top 0.2: v37.93,42.73 37.32,42.73 36.32,41.73
  Top 0.305: IC1.9 36.32,41.73
  Bottom 0.2: v39.7,31.5 37.07,34.13 37.07,35.22 36.96,35.34 36.96,41.76 v37.93,42.73
PD6  (via drill 0.35)
  Top 0.2: 35.8,41.75 36.65,42.61 36.65,43.32 v37.13,43.79 | IC5.9 38.77,31.48 v38.75,31.5
  Top 0.305: 35.8,41.75 35.8,40.56 IC1.10
  Bottom 0.2: v38.75,31.5 36.75,33.62 36.75,35.09 36.62,35.21 36.62,43.29 v37.13,43.79
PD7  (via drill 0.35)
  Top 0.2: v36.06,43.75 v36.05,43.74 36.05,42.55 35.32,41.82
  Top 0.305: IC1.11 35.32,41.82
  Bottom 0.2: v37.8,31.5 36.42,32.95 36.42,34.95 35.81,35.56 35.81,41.62 36.06,41.87 v36.06,43.74 v36.06,43.75
RESET  (via drill 0.35)
  Top 0.2: R2.1 40.1,44.34 v38.82,44.34 | 34.82,34.79 34.76,34.73 | C11.2 26.81,31.25 v27.66,30.41
  Top 0.305: IC1.29 34.82,34.79 | 34.76,34.73 v34.76,32.45
  Bottom 0.2: J3.A3 26.54,30.46 27.73,31.65 | 29.24,39.34 32.3,42.4 32.54,42.16 | 32.54,42.16 | 29.24,39.34 33.28,43.38 33.76,43.38 34.64,44.26 35.67,44.26 36.54,45.13 38.03,45.13 v38.82,44.34 | 27.73,31.65 29.24,33.17 29.24,39.34 | v34.76,32.45 34.76,34.63 32.73,36.66 32.73,41.97 32.54,42.16 | v27.66,30.41 27.66,31.58 27.73,31.65
SCK  (via drill 0.35)
  Top 0.2: v31.69,43.26 30.49,42.06 30.49,40.3 30.96,39.83 | v22.86,24.88 16.62,24.88 16.31,25.19 15.5,25.19 14.93,24.62 14.93,21.27 15.91,20.3 IC5.4
  Top 0.305: IC1.17 30.96,39.83
  Bottom 0.2: v31.69,43.26 28.56,40.13 28.56,33.41 24,28.85 J3.A2 24,26.02 v22.86,24.88
UART_MEGA_RXD  (via drill 0.35)
  Top 0.2: 35.32,32.85 36.04,32.13 40.11,32.13 40.65,31.59 v40.65,31.5 | R11.2 8.34,16.39 10.69,16.39 11.58,17.28 11.46,17.41 11.46,21.58 12.83,22.95 12.81,22.97 12.81,27.33 14.14,28.66 v27.84,28.66 27.87,28.63 30.62,28.63 30.99,28.26 30.99,22.52 31.83,21.68 IC5.11
  Top 0.305: IC1.30 35.32,32.85
  Bottom 0.2: v27.84,28.66 38.7,28.66 40.65,30.61 v40.65,31.5
UART_MEGA_TXD  (via drill 0.35)
  Top 0.2: 35.82,32.91 36.27,32.46 40.79,32.46 41.6,31.64 v41.6,31.5 | R10.2 8.28,16.04 10.8,16.04 11.91,17.15 11.91,17.42 11.79,17.54 11.79,21.45 13.16,22.82 13.16,23.09 13.14,23.11 13.14,27.2 14.24,28.3 17.12,28.3 22.64,28.3 26.92,28.3 27.21,28.01 27.89,28.01 v30.36,28 30.36,20.95 32.17,19.14 IC5.12
  Top 0.305: IC1.31 35.82,32.91
  Bottom 0.2: v30.36,28 38.56,28.01 41.6,31.05 v41.6,31.5
USB_DN  (via drill 0.35)
  Top 0.2: D1.3 17.32,33.25 16.78,32.72 16.78,32.1 15.76,31.08 12.89,31.08 12.28,30.48 12.28,29.22 | 12.28,29.22 12.28,25.99 12.28,25.84 11.24,24.8 X1.2 | IC2.4 3.77,12.34 3.36,12.34 2.8,12.9 v2.4,12.9 | v12.09,29.2 12.27,29.2 12.28,29.22
  Bottom 0.2: v2.4,12.9 2.4,13.9 2.13,14.17 2.13,19.25 v12.09,29.2
USB_DP  (via drill 0.35)
  Top 0.2: D1.4 19.07,31.39 17.88,31.39 v17.05,30.56 | v11.36,24.03 11.33,24 | 11.33,24 X1.3 | IC2.3 3.77,12.84 3.36,12.84 2.13,14.06 2.13,14.69 2.5,15.06 3.03,15.06 3.06,15.02 v3.74,15.02 | 11.33,24 10,22.67 10,18.59 9.71,18.3 9.39,18.3 v9.02,17.92
  Bottom 0.2: v11.36,24.03 12.72,25.39 12.72,30.2 13.17,30.66 16.95,30.66 v17.05,30.56 | v3.74,15.02 6.64,17.92 v9.02,17.92
USBVCC  (via drill 0.35)
  Top 0.2: X1.1 10.4,25.6 11.24,25.6 11.3,25.66 v11.3,27.23 11.3,29.96 12.75,31.41 15.63,31.41 16.45,32.23 16.45,33.31 15.27,34.49 Q1.2 19.85,34.67 D1.2 | R7.2 9.87,9.09 v9.87,10.15
  Bottom 0.2: v9.87,10.15 9.87,25.8 v11.3,27.23
VCC  (via drill 0.35)
  Top 0.2: R3.1 7.6,34.8 7.24,35.17 4.43,35.17 4.21,34.95 v4.21,34.86 | v6.82,37.78 6.82,37.47 6.32,36.97 | R12.2 15.04,37.2 14.8,36.97
  Top 0.5: J1.3 23,36.95 22.85,37.1 22.85,37.63 | 22.85,37.63 C3.2 C2.+ | IC3.3 3.67,39.62 6.32,36.97 14.8,36.97 20.15,36.97 20.81,37.63 22.85,37.63
  Bottom 0.2: v4.21,34.86 4.21,35.2 v6.8,37.79 | v6.8,37.79 | v6.8,37.79 v6.82,37.78
  Bottom 0.5: 24.97,12.2 J2.3
  Bottom 0.813: J1.3 23,45.92 23.65,46.57 46.02,46.57 46.55,46.05 46.55,2.59 45.4,1.45 27.64,1.45 24.97,4.12 24.97,12.2

### Text on the board
tNames: Power | PWM | AN | INT | RST | RX | CS | TX | SCK | SCL | MISO | SDA | MOSI | 5V | 3.3V | GND | GND